# Altium schematic sheet buoi122.SchDoc
size A4
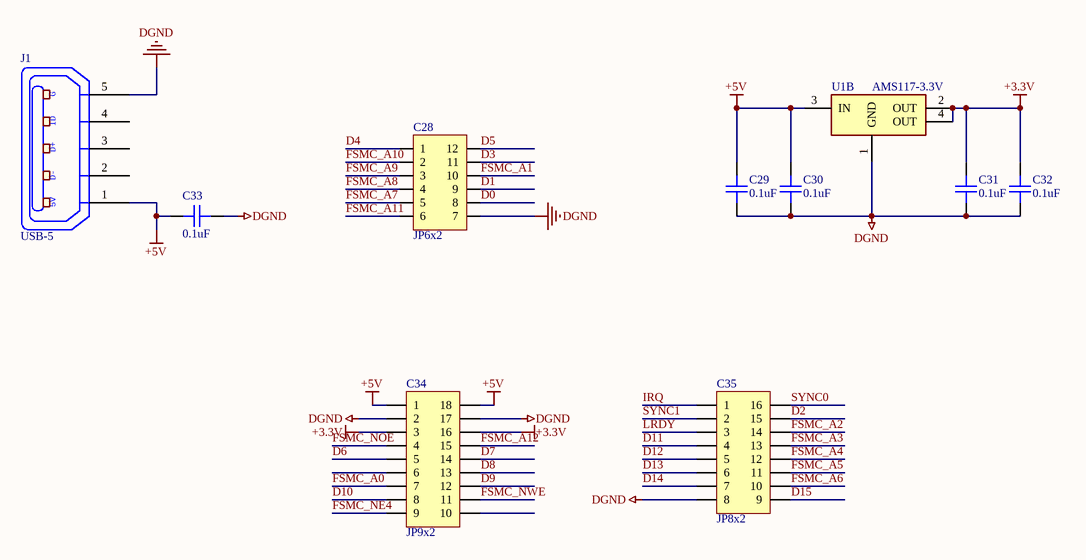
[diagram p0: buoi122.SchDoc]

## Parts
C28  JP6x2  [JP6-C2T]
C29  0.1uF  [CAPC-0603 (1608)]
C30  0.1uF  [CAPC-0603 (1608)]
C31  0.1uF  [CAPC-0603 (1608)]
C32  0.1uF  [CAPC-0603 (1608)]
C33  0.1uF  [CAPC-0603 (1608)]
C34  JP9x2  [JP9-C2T]
C35  JP8x2  [JP8-C2T]
J1  USB-5  [USB-M1]
U1  AMS117-3.3V  [SOT223]  (part B of 2)

## Nets
+3.3V: C31.2 C32.2 C34.3 C34.16 U1.2(OUT) U1.4(OUT)
+5V: C29.2 C30.2 C33.2 C34.1 C34.18 J1.1(P1) U1.3(IN)
DGND: C28.7 C29.1 C30.1 C31.1 C32.1 C33.1 C34.2 C34.17 C35.8 J1.5(P5) U1.1(GND)
D0: C28.8
D1: C28.9
D2: C35.15
D3: C28.11
D4: C28.1
D5: C28.12
D6: C34.5
D7: C34.14
D8: C34.13
D9: C34.12
D10: C34.8
D11: C35.4
D12: C35.5
D13: C35.6
D14: C35.7
D15: C35.9
FSMC_A0: C34.7
FSMC_A1: C28.10
FSMC_A2: C35.14
FSMC_A3: C35.13
FSMC_A4: C35.12
FSMC_A5: C35.11
FSMC_A6: C35.10
FSMC_A7: C28.5
FSMC_A8: C28.4
FSMC_A9: C28.3
FSMC_A10: C28.2
FSMC_A11: C28.6
FSMC_A12: C34.15
FSMC_NE4: C34.9
FSMC_NOE: C34.4
FSMC_NWE: C34.11
IRQ: C35.1
LRDY: C35.3
SYNC0: C35.16
SYNC1: C35.2

Not connected (* = marked no-connect by the designer): C34 6 10; J1 2(P2) 3(P3) 4(P4)

## Notes on the sheet
- (in symbol USB-5) G; ID; D+; D-; 5V

## Library data of the parts
C28 = JP6x2: WR-PHD 2.54 mm Dual Socket Header; Manufacturer: W¨¹rth Elektronik eiSos GmbH; partNo: 61301221821; ComponentLink1 Description: Manufacturer; ComponentLink2 Description: Datasheet; NoPins: 12; Created Date: 29 March 2013; ComponentLink1URL: http://www.we-online.com; ComponentLink2URL: http://katalog.we-online.de/em/datasheet/6130xx21821.pdf; Created by: Karrer Zheng
C29-C33 = C0603C104K5RACTU: CAP CER 0.1uF 50V 10% X7R 0603; CompanyID: VT-00982; Solder: SMT; Value: 104/50V; MPN: C0603C104K5RACTU; Category: CAPACITOR; PinCount: 2
C34 = JP9x2: WR-PHD 2.54 mm Dual Socket Header; Manufacturer: W¨¹rth Elektronik eiSos GmbH; partNo: 61301821821; ComponentLink1 Description: Manufacturer; ComponentLink2 Description: Datasheet; NoPins: 18; Created Date: 29 March 2013; ComponentLink1URL: http://www.we-online.com; ComponentLink2URL: http://katalog.we-online.de/em/datasheet/6130xx21821.pdf; Created by: Karrer Zheng
C35 = JP8x2: WR-PHD 2.54 mm Dual Socket Header; Manufacturer: W¨¹rth Elektronik eiSos GmbH; partNo: 61301621821; ComponentLink1 Description: Manufacturer; ComponentLink2 Description: Datasheet; NoPins: 16; Created Date: 29 March 2013; ComponentLink1URL: http://www.we-online.com; ComponentLink2URL: http://katalog.we-online.de/em/datasheet/6130xx21821.pdf; Created by: Karrer Zheng
J1 = USB-5: Manufacturer: FCI; Manufacturer Part Number: 10118193-0001LF; Connector Type: USB - micro B; Number of Contacts: 5; Gender: Receptacle; Specifications: USB 2.0; .Creator: MM; .Checked PCB: RF; Supplier 1: Digi-Key; RoHS: RoHS Compliant; Category: Connectors, Interconnects; Stock 1: 28642; Pricing 1: 1=0.46, 10=0.433, 25=0.3712, 50=0.3156, 100=0.3032, 250=0.27224, 500=0.25988 (USD); Packaging: Cut Tape (CT); Mounting Type: Surface Mount, Right Angle, Horizontal; Features: Shielded, Solder Retention; Ingress Protection: -; ComponentLink1URL: http://portal.fciconnect.com/Comergent//fci/drawing/10118193.pdf; ComponentLink1Description: http://portal.fciconnect.com/Comergent//fci/drawing/10118193.pdf; Supplier Part Number 1: 609-4616-1-ND; .Checked SCH: MM
U1 = AMS117-1.2V